# EAGLE design Neonatal_Circuit (EAGLE 9.6.2)
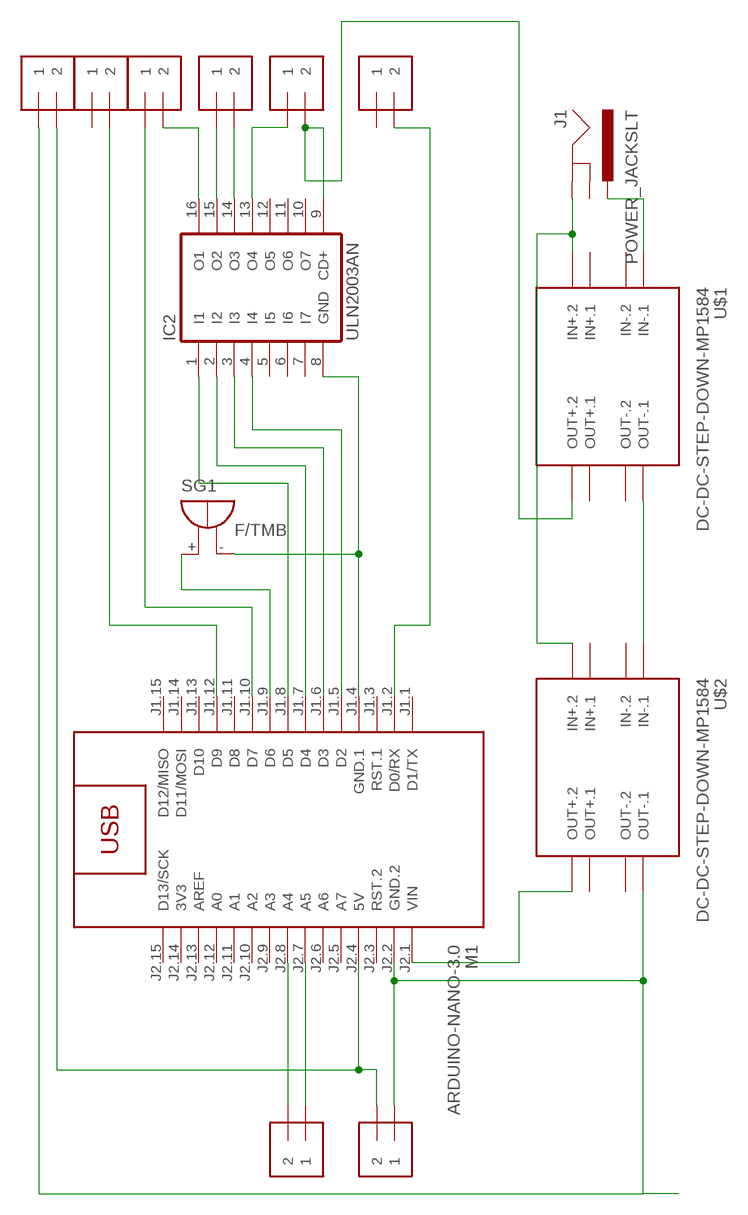
[diagram p0: schematic, sheet 1]

## Parts
IC2  ULN2003AN  [DIL16]
J1  POWER_JACKSLT  [POWER_JACK_SLOT]
J2  1X2-3.5MM  [1X2-3.5MM]
J3  1X2-3.5MM  [1X2-3.5MM]
J4  1X2-3.5MM  [1X2-3.5MM]
J5  1X2-3.5MM  [1X2-3.5MM]
J6  1X2-3.5MM  [1X2-3.5MM]
J7  1X2-3.5MM  [1X2-3.5MM]
J8  1X2-3.5MM  [1X2-3.5MM]
J9  1X2-3.5MM  [1X2-3.5MM]
M1  ARDUINO-NANO-3.0  [ARDUINO-NANO-3.0]
SG1  F/TMB  [F/TMB]
U$1  DC-DC-STEP-DOWN-MP1584  [DC-DC-STEP-DOWN-MP1584]
U$2  DC-DC-STEP-DOWN-MP1584  [DC-DC-STEP-DOWN-MP1584]

## Nets
N$1: IC2.4(I4) M1.J1.5(D2)
N$2: IC2.3(I3) M1.J1.6(D3)
N$3: IC2.2(I2) M1.J1.7(D4)
N$4: IC2.1(I1) M1.J1.8(D5)
N$5: J1.PWR U$1.IN-.1
N$6: J1.GND@2(GND) U$1.IN+.2 U$2.IN+.2
N$7: U$1.OUT-.1 U$2.IN-.1
N$8: M1.J2.1(VIN) U$2.OUT+.2
N$9: IC2.16(O1) J6.2
N$10: IC2.15(O2) J5.1
N$11: IC2.14(O3) J5.2
N$12: IC2.13(O4) J4.1
N$13: IC2.8(GND) M1.J1.4(GND.1) SG1.-
N$14: M1.J1.9(D6) SG1.+
N$15: J2.2 M1.J1.12(D9)
N$17: J7.2 J8.2 M1.J2.4(5V)
N$18: J3.2 M1.J1.2(D0/RX)
N$19: J9.1 M1.J2.7(A5)
N$20: J9.2 M1.J2.8(A4)
N$21: IC2.9(CD+) J4.2 U$1.OUT+.2
N$22: J7.1 J8.1 M1.J2.2(GND.2) U$2.OUT-.1
N$24: J6.1 M1.J1.10(D7)
Unconnected: IC2.5(I5) IC2.6(I6) IC2.7(I7) IC2.10(O7) IC2.11(O6) IC2.12(O5) J1.GND@1(GNDBREAK) J2.1 J3.1 M1.J1.1(D1/TX) M1.J1.3(RST.1) M1.J1.11(D8) M1.J1.13(D10) M1.J1.14(D11/MOSI) M1.J1.15(D12/MISO) M1.J2.3(RST.2) M1.J2.5(A7) M1.J2.6(A6) M1.J2.9(A3) M1.J2.10(A2) M1.J2.11(A1) M1.J2.12(A0) M1.J2.13(AREF) M1.J2.15(D13/SCK) U$1.IN+.1 U$1.IN-.2 U$1.OUT+.1 U$1.OUT-.2 U$2.IN+.1 U$2.IN-.2 U$2.OUT+.1 U$2.OUT-.2

## Power pins joined to a net without a drawn wire
3V3: M1.J2.14(3V3)

## Library data of the parts
IC2 = uln-udn:ULN2003A: DRIVER ARRAY
J1 = GHIISparkFun-Connectors:POWER_JACK: Power Jack Connector This is the standard 5.5mm barrel jack for power. The PTH is the most common, proven, reliable, footprint. The Slot footprint only works if the mill layer is transmitted to the PCB fab house so be warned. Here are the connectors we sell at SparkFun: DC Barrel Power Jack/Connector <https://www.sparkfun.com/products/119> (PRT-00119) DC Barrel Power Jack/Connector (SMD) <https://www.sparkfun.com/products/12748> (PRT-12748) DC Barrel Jack Adapter - Breadboard Compatible <https://www.sparkfun.com/products/10811> (PRT-10811) It is used on this SparkFun product (and many, many others): SparkFun RedBoard - Programmed with Arduino <https://www.sparkfun.com/products/12757> (DEV-12757) Also, if you need a mating power supply or connector, please check these out: Wall Adapter Power Supply - 9VDC 650mA <https://www.sparkfun.com/products/298> (TOL-00298) DC Barrel Jack Adapter - Male <https://www.sparkfun.com/products/10287> (PRT-10287); PROD_ID: PRT-00119
J2-J9 = adafruit:1X2: 3.5mm Terminal block http://www.ladyada.net/library/pcb/eaglelibrary.html
M1 = GHIdiy-modules:ARDUINO-NANO-3.0: Arduino Nano 3.0 and compatible devices More details available here: https://www.arduino.cc/en/Main/ArduinoBoardNano Click here to find device on ebay.com <http://www.ebay.com/sch/arduino+nano>
SG1 = buzzer:F/TMB: BUZZER Source: Buerklin; OC_FARNELL: unknown; OC_NEWARK: unknown
U$1 U$2 = GHIdiy-modules:DC-DC-STEP-DOWN-MP1584: DC/DC Step-Down Regulator based on MP1584 chip MP1584 datasheet available here: http://www.haoyuelectronics.com/Attachment/MP1584/MP1584.pdf Click here to find device on ebay.com <http://www.ebay.com/sch/mp1584+module>

## Board
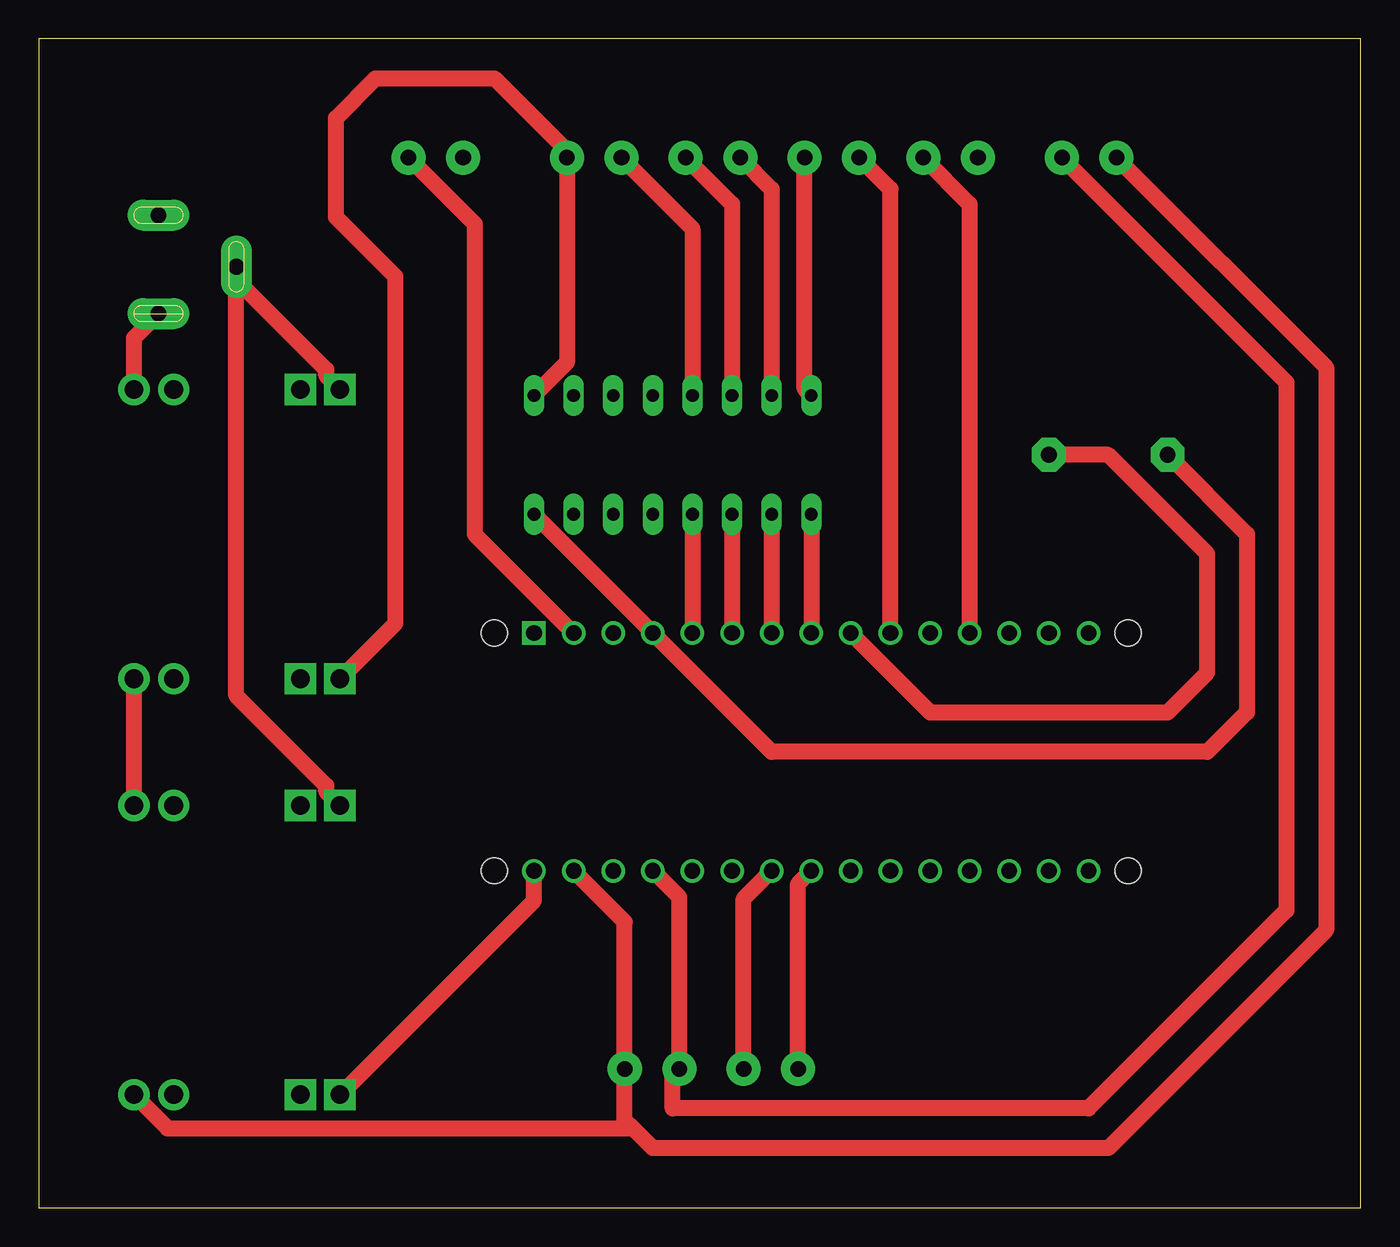
[diagram p1: board, top side]
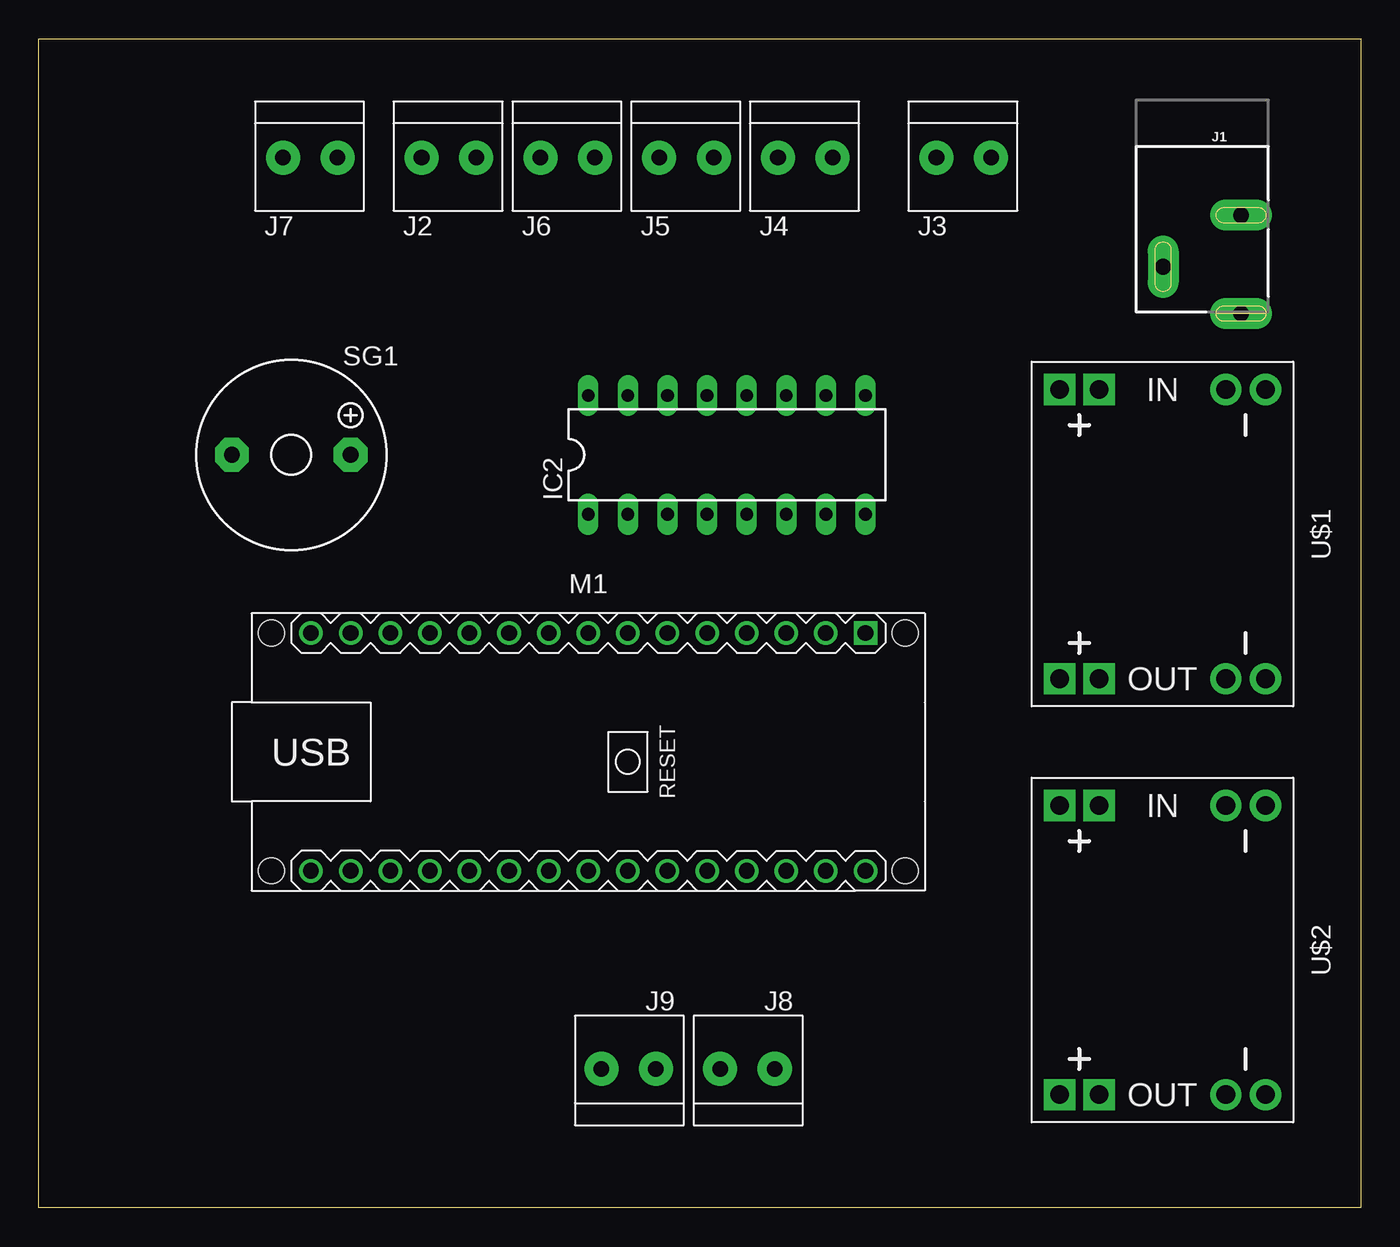
[diagram p2: board, bottom side, seen from below]

Size 84.76 x 74.92 mm. Coordinates in mm from the lower left corner, seen from the top.
Outline: 0,0 84.76,0 84.76,74.92 0,74.92 0,0
Copper layers (1*16): Top 0.035mm / dielectric 1.5mm / Bottom 0.035mm
Design rules "default": minimum track width 6mil, minimum drill 0.35mm, track to track 6mil, track to pad 6mil, pad to pad 6mil, via to via 6mil, smd to smd 6mil, copper to edge 40mil, drill to drill 6mil, minimum pad ring 10mil, minimum via ring 8mil, stop-mask expansion 4mil, vias tented up to drill 0mil, thermal gap 10mil

### Footprints (pad centres in the part's own frame; a part is rotated, then mirrored left to right if it is on the bottom)
DIL16 = drill 0.813 long: 1 -8.89,-3.81; 2 -6.35,-3.81; 3 -3.81,-3.81; 4 -1.27,-3.81; 5 1.27,-3.81; 6 3.81,-3.81; 7 6.35,-3.81; 8 8.89,-3.81; 9 8.89,3.81; 10 6.35,3.81; 11 3.81,3.81; 12 1.27,3.81; 13 -1.27,3.81; 14 -3.81,3.81; 15 -6.35,3.81; 16 -8.89,3.81
POWER_JACK_SLOT = drill 1 pad 2 long: GND@1 2.58,7.5; GND@2 7.58,10.8; PWR 2.58,13.8
1X2-3.5MM = drill 1 pad 2.184: 1 1.8,0; 2 -1.7,0
ARDUINO-NANO-3.0 = drill 1 square: J1.1 17.78,7.62 | drill 1: J1.2 15.24,7.62; J1.3 12.7,7.62; J1.4 10.16,7.62; J1.5 7.62,7.62; J1.6 5.08,7.62; J1.7 2.54,7.62; J1.8 0,7.62; J1.9 -2.54,7.62; J1.10 -5.08,7.62; J1.11 -7.62,7.62; J1.12 -10.16,7.62; J1.13 -12.7,7.62; J1.14 -15.24,7.62; J1.15 -17.78,7.62; J2.1 17.78,-7.62; J2.2 15.24,-7.62; J2.3 12.7,-7.62; J2.4 10.16,-7.62; J2.5 7.62,-7.62; J2.6 5.08,-7.62; J2.7 2.54,-7.62; J2.8 0,-7.62; J2.9 -2.54,-7.62; J2.10 -5.08,-7.62; J2.11 -7.62,-7.62; J2.12 -10.16,-7.62; J2.13 -12.7,-7.62; J2.14 -15.24,-7.62; J2.15 -17.78,-7.62 | hole 1.651: -20.32,7.62; -20.32,-7.62; 20.32,-7.62; 20.32,7.62
F/TMB = drill 1.016 pad 2.159 octagon: + 3.81,0; - -3.81,0
DC-DC-STEP-DOWN-MP1584 = drill 1.2 pad 2 square: IN+.1 -9.271,-4.064; IN+.2 -9.271,-6.604; OUT+.1 9.271,-4.064; OUT+.2 9.271,-6.604 | drill 1.2 pad 2: IN-.1 -9.271,6.604; IN-.2 -9.271,4.064; OUT-.1 9.271,6.604; OUT-.2 9.271,4.064

### Placement (x,y rotation side)
IC2  40.64,48.26 0 bottom
J1  5.08,71.12 180 bottom
J2  58.42,67.31 180 bottom
J3  25.4,67.31 180 bottom
J4  35.56,67.31 180 bottom
J5  43.18,67.31 180 bottom
J6  50.8,67.31 180 bottom
J7  67.31,67.31 180 bottom
J8  39.37,8.89 0 bottom
J9  46.99,8.89 0 bottom
M1  49.53,29.21 0 bottom
SG1  68.58,48.26 0 bottom
U$1  12.7,43.18 270 bottom
U$2  12.7,16.51 270 bottom

### Tracks (layer width: path | path; a pad name or v marks a point on that pad's centre or on a via)
N$1
  Top 1.016: IC2.4 M1.J1.5
N$2
  Top 1.016: IC2.3 M1.J1.6
N$3
  Top 1.016: IC2.2 M1.J1.7
N$4
  Top 1.016: IC2.1 M1.J1.8
N$5
  Top 1.016: U$1.IN-.1 6.1,55.76 J1.PWR
N$6
  Top 1.016: U$2.IN+.2 18.42,26.66 18.42,27.05 12.66,32.82 J1.GND@2 12.66,59.49 18.42,53.72 18.42,53.33 U$1.IN+.2
N$7
  Top 1.016: U$2.IN-.1 U$1.OUT-.1
N$8
  Top 1.016: U$2.OUT+.2 31.75,19.69 M1.J2.1
N$9
  Top 1.016: IC2.16 49.1,52.5 J6.2
N$10
  Top 1.016: J5.1 46.99,65.3 IC2.15
N$11
  Top 1.016: J5.2 44.45,64.34 IC2.14
N$12
  Top 1.016: J4.1 41.91,62.76 IC2.13
N$13
  Top 1.016: SG1.- 77.47,43.18 77.47,31.75 74.93,29.21 46.99,29.21 M1.J1.4 IC2.8
N$14
  Top 1.016: M1.J1.9 57.15,31.75 72.39,31.75 74.93,34.29 74.93,41.91 68.58,48.26 SG1.+
N$15
  Top 1.016: J2.2 59.69,64.34 M1.J1.12
N$17
  Top 1.016: J7.2 80.01,52.91 80.01,19.05 67.31,6.35 40.64,6.35 40.64,8.46 J8.2 41.07,19.89 M1.J2.4
N$18
  Top 1.016: J3.2 27.94,63.07 27.94,43.18 M1.J1.2
N$19
  Top 1.016: J9.1 45.19,19.79 M1.J2.7
N$20
  Top 1.016: J9.2 48.69,20.75 M1.J2.8
N$21
  Top 1.016: U$1.OUT+.2 22.86,37.46 22.86,59.69 19.05,63.5 19.05,69.85 21.59,72.39 29.21,72.39 33.86,67.74 J4.2 33.86,54.18 IC2.9
N$22
  Top 1.016: J7.1 82.55,53.87 82.55,17.78 68.58,3.81 39.37,3.81 38.1,5.08 | 38.1,5.08 37.57,5.61 J8.1 37.57,18.31 M1.J2.2 | U$2.OUT-.1 8.25,5.08 38.1,5.08
N$24
  Top 1.016: M1.J1.10 54.61,65.3 J6.1